# EAGLE schematic MSSRP-HUMID_TEMP_SENSE (EAGLE 6.6.0)
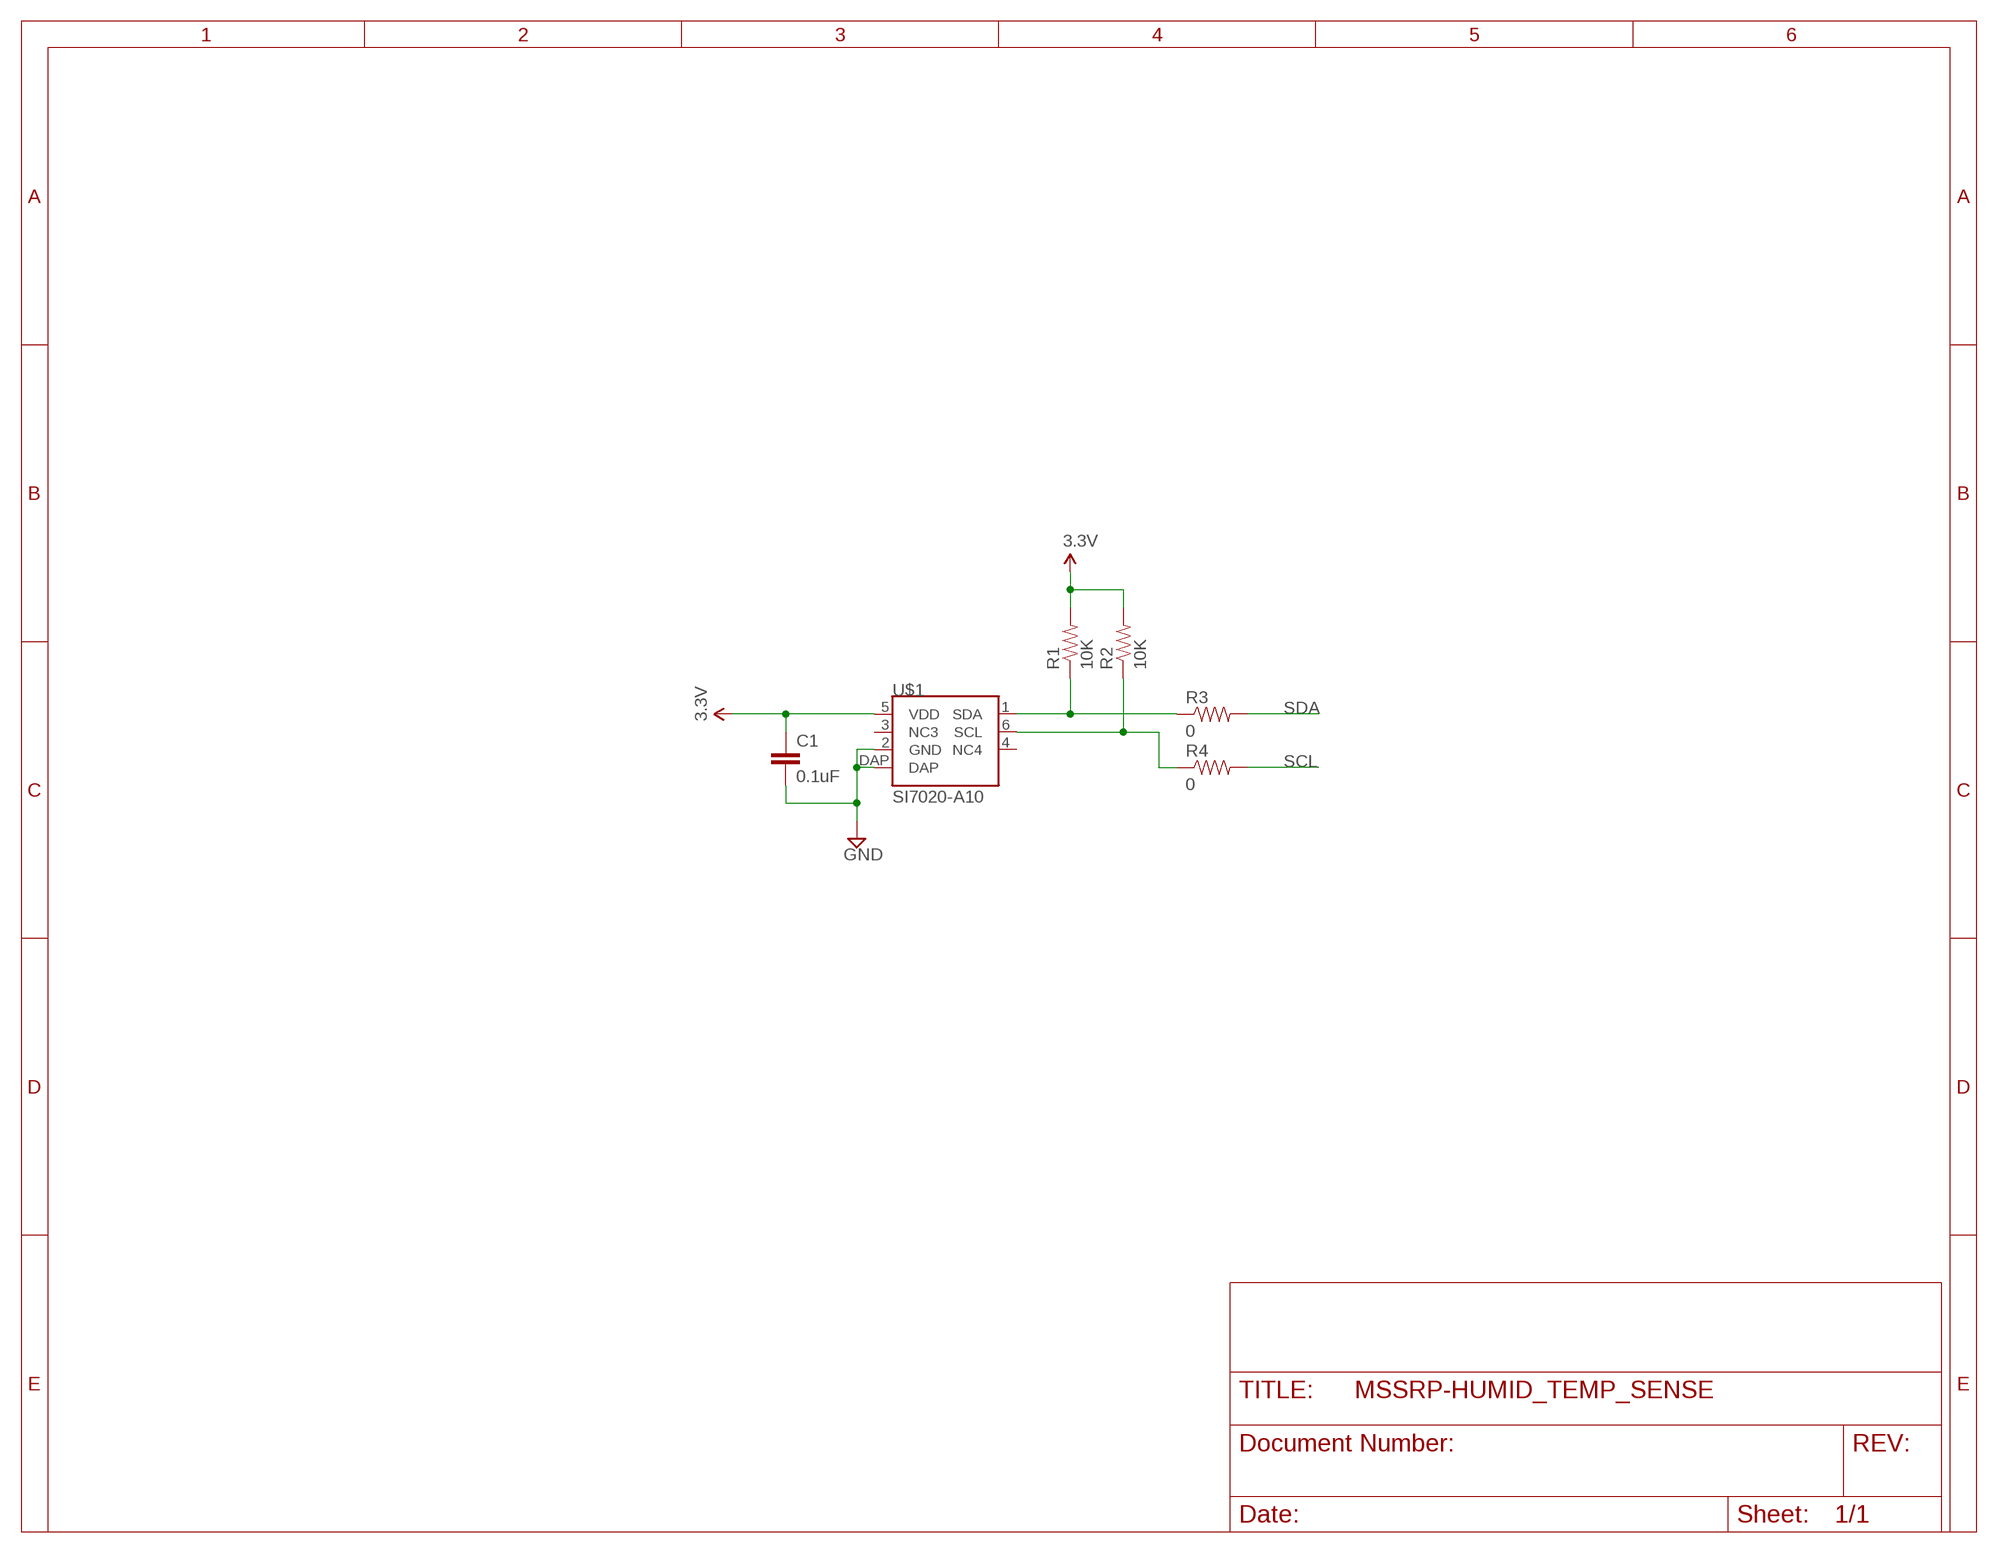
[diagram p0: schematic, sheet 1]

## Parts
C1  0.1uF  0.1UF-25V-5%(0603)  [0603-CAP]
R1  10K  10KOHM1/10W1%(0603)0603  [0603-RES]
R2  10K  10KOHM1/10W1%(0603)0603  [0603-RES]
R3  0  0OHM1/10W5%(0603)  [0603]
R4  0  0OHM1/10W5%(0603)  [0603]
U$1  SI7020-A10  [DFN6]

## Nets
3.3V: C1.1 R1.2 R2.2 U$1.5(VDD)
GND: C1.2 U$1.2(GND) U$1.DAP
N$3: R1.1 R3.1 U$1.1(SDA)
N$4: R2.1 R4.1 U$1.6(SCL)
SCL: R4.2
SDA: R3.2
Unconnected: U$1.3(NC3) U$1.4(NC4)

## Library data of the parts
C1 = SparkFun-Capacitors:0.1UF-25V-5%(0603): CAP-08604; PROD_ID: CAP-08604
R1 R2 = SparkFun-Resistors:10KOHM1/10W1%(0603): RES-00824; PROD_ID: RES-00824
R3 R4 = SparkFun-Resistors:0OHM1/10W5%(0603): RES-08609; PROD_ID: RES-08609
U$1 = MSSRP-Lib:SI7020